# Altium schematic sheet DIOT_Connectors_P1_P6.SchDoc: Switch Matrix 32:2
size 420 x 297 mm; SPICEModelCacheRMUUFYQV: <root> / <DocumentId>RMUUFYQV</DocumentId> / </root>; Author: G.Kasprowicz; CompanyName: WUT ISE; DrawnBy: G.Kasprowicz; Organization: WUT ISE; Address1: PW ISE; Address2: Nowowiejska 15/19 00-665 Warsaw; Address3: gkasprow@gmail.com; DocumentNumber: 5; Revision: 2; SheetNumber: 5; SheetTotal: 6; ModifiedBy: -; CheckedDate: -; Title2: DIOT connectors; DivGrp: WUT ISE; Designer: G.Kasprowicz; ModifiedDate: -; ProjectName: Sensor Box
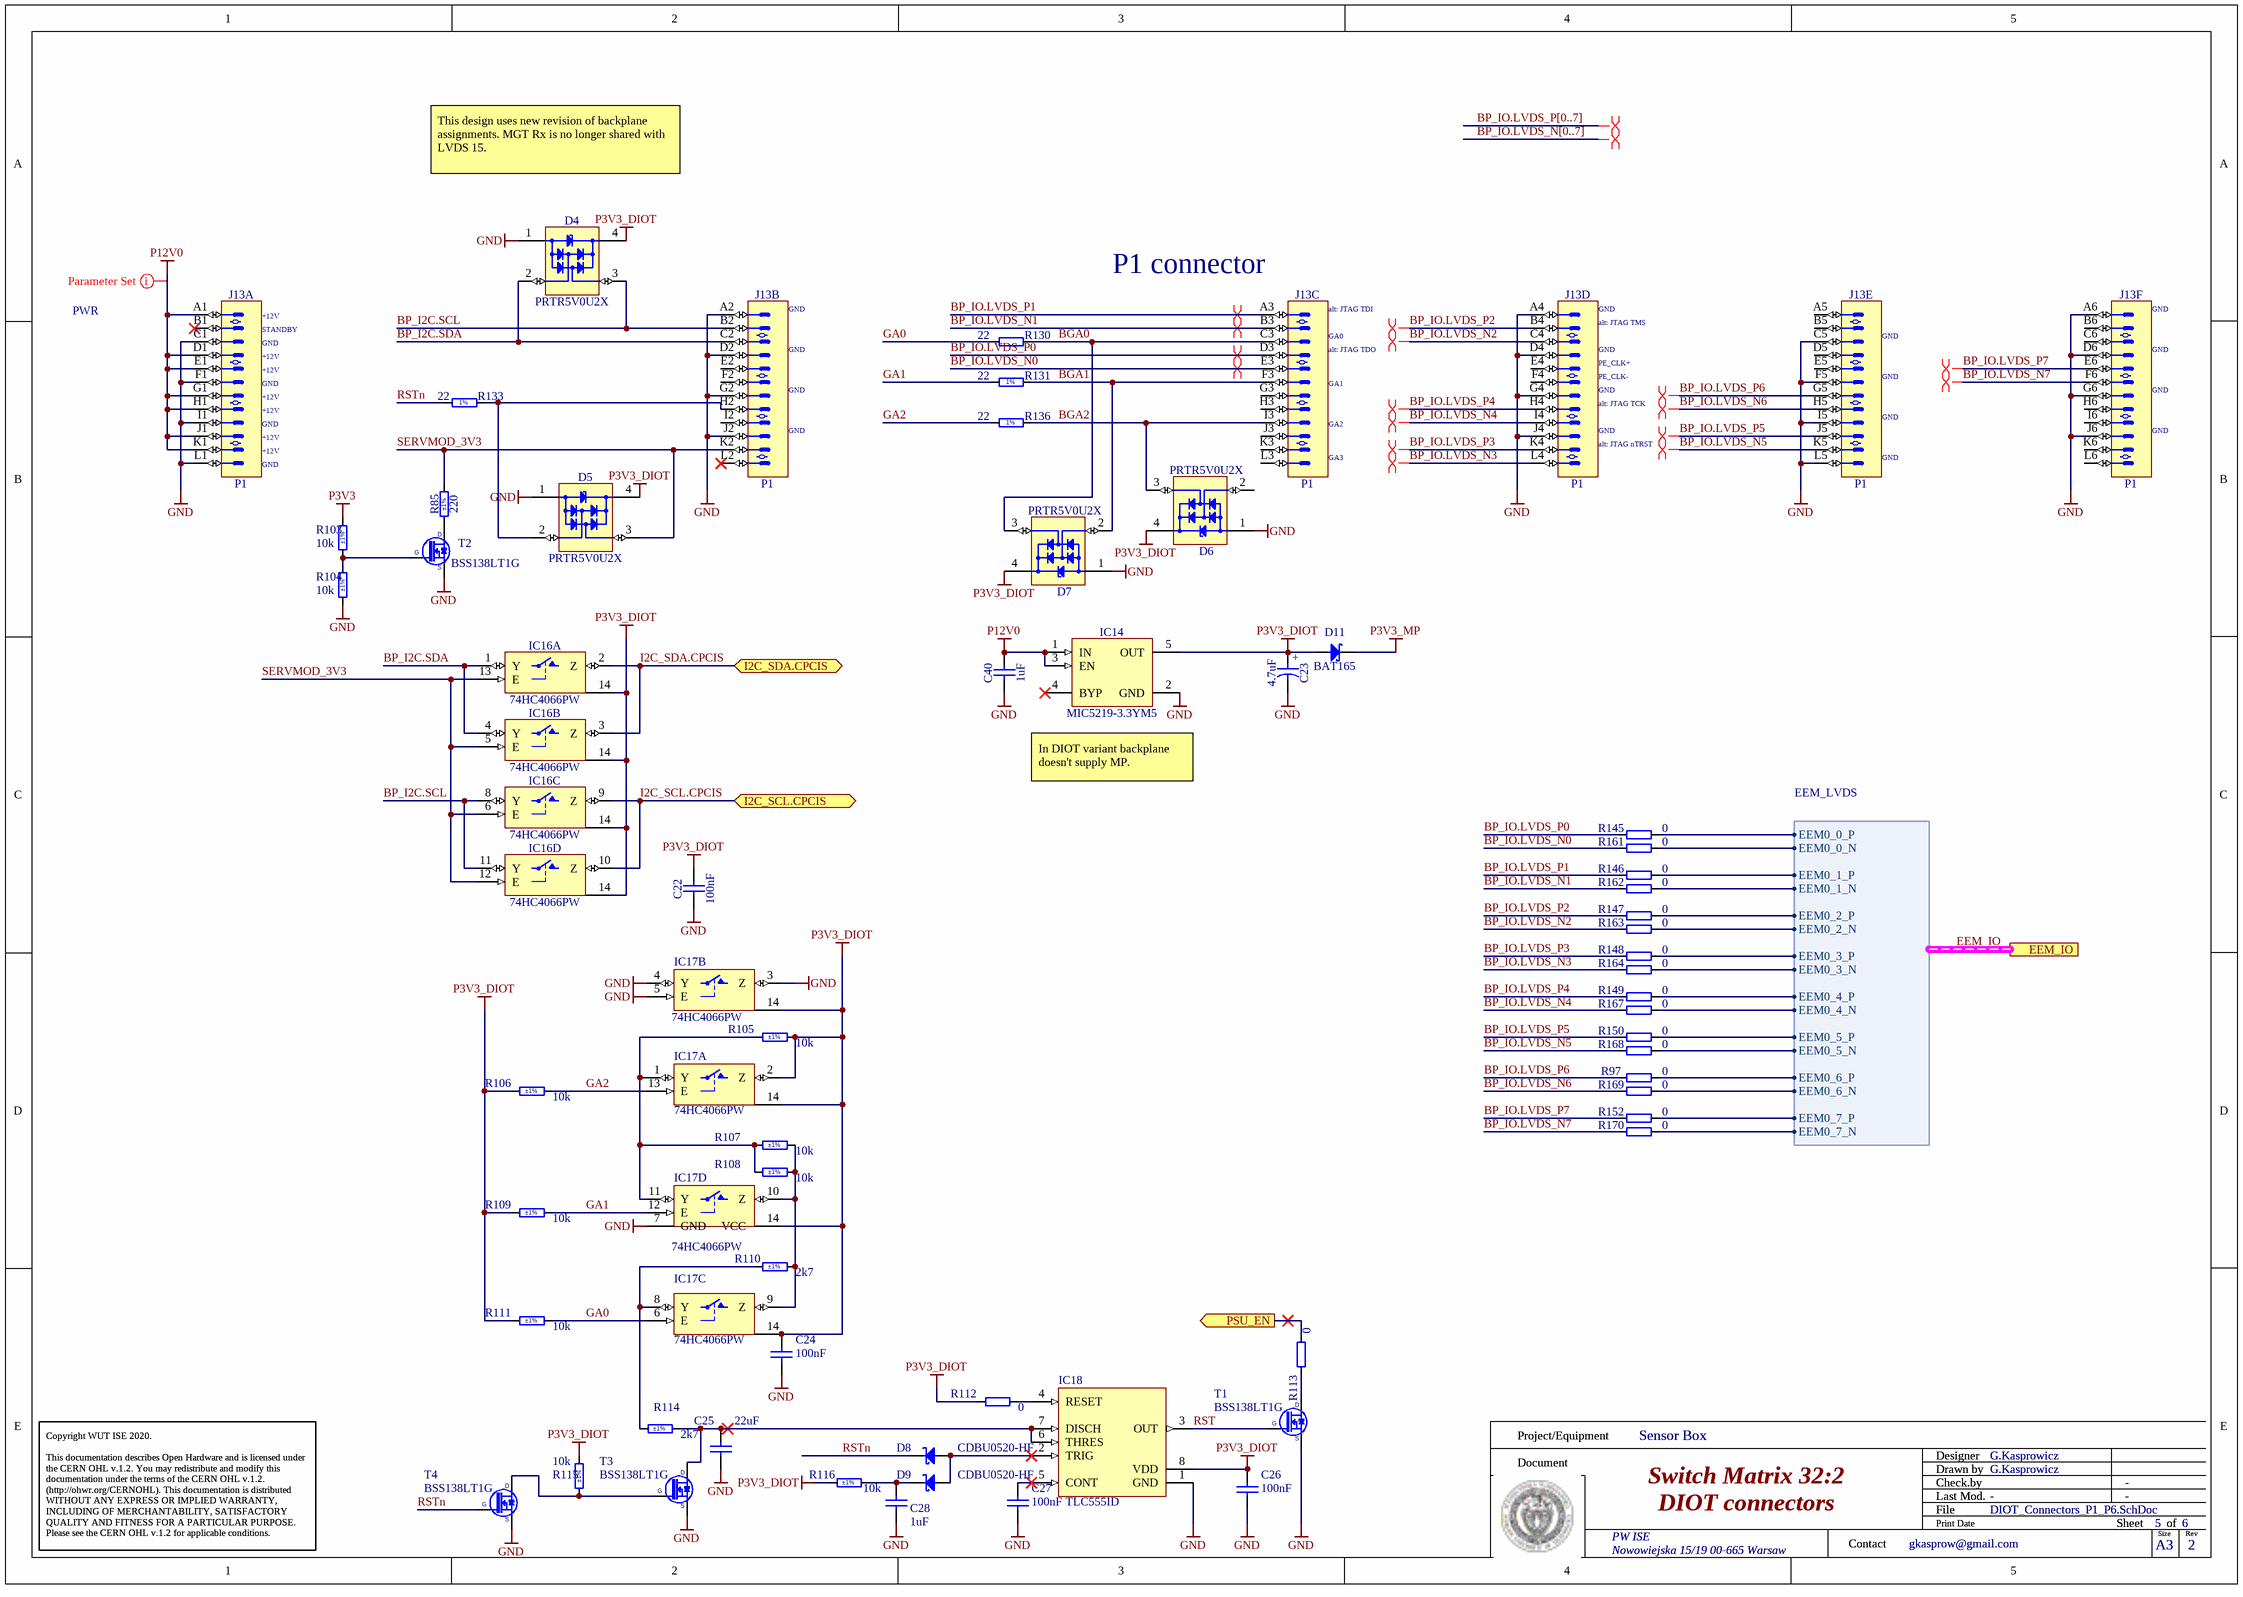
[diagram p0: DIOT_Connectors_P1_P6.SchDoc]

## Parts
C22  100nF  [CAPC1608X87N]
C23  4.7uF  [CAPMP3216X180N]
C24  100nF  [CAPC1608X87N]
C25  22uF  [CAPC2012X135N]
C26  100nF  [CAPC1608X87N]
C27  100nF  [CAPC1608X87N]
C28  1uF  [CAPC1608X87N]
C40  1uF  [CAPC1608X87N]
D4  PRTR5V0U2X  [SOT190P230X110-4N]
D5  PRTR5V0U2X  [SOT190P230X110-4N]
D6  PRTR5V0U2X  [SOT190P230X110-4N]
D7  PRTR5V0U2X  [SOT190P230X110-4N]
D8  CDBU0520-HF  [SOD-523F]
D9  CDBU0520-HF  [SOD-523F]
D11  BAT165  [SOD2512X110N]
IC14  MIC5219-3.3YM5  [SOT95P280X145-5N]
IC16  74HC4066PW  [SOP65P640X110-14N]  (parts A,B,C,D of 4)
IC17  74HC4066PW  [SOP65P640X110-14N]  (parts A,B,C,D of 4)
IC18  TLC555ID  [SOIC127P600X175-8N]
J13  P1  [AMPHENOL_10052825-101LF]  (parts A,B,C,D,E,F of 6)
R85  220  Tolerance: ±1%  [RESC1005X40N]
R97  0  [RESC1608X55N]
R103  10k  Tolerance: ±1%  [RESC1608X55N]
R104  10k  Tolerance: ±1%  [RESC1608X55N]
R105  10k  Tolerance: ±1%  [RESC1608X55N]
R106  10k  Tolerance: ±1%  [RESC1608X55N]
R107  10k  Tolerance: ±1%  [RESC1608X55N]
R108  10k  Tolerance: ±1%  [RESC1608X55N]
R109  10k  Tolerance: ±1%  [RESC1608X55N]
R110  2k7  Tolerance: ±1%  [RESC1608X55N]
R111  10k  Tolerance: ±1%  [RESC1608X55N]
R112  0  [RESC1608X55N]
R113  0  [RESC1608X55N]
R114  2k7  Tolerance: ±1%  [RESC1608X55N]
R115  10k  Tolerance: ±1%  [RESC1608X55N]
R116  10k  Tolerance: ±1%  [RESC1608X55N]
R130  22  [RESC1005X40N]
R131  22  [RESC1005X40N]
R133  22  [RESC1005X40N]
R136  22  [RESC1005X40N]
R145  0  [RESC1608X55N]
R146  0  [RESC1608X55N]
R147  0  [RESC1608X55N]
R148  0  [RESC1608X55N]
R149  0  [RESC1608X55N]
R150  0  [RESC1608X55N]
R152  0  [RESC1608X55N]
R161  0  [RESC1608X55N]
R162  0  [RESC1608X55N]
R163  0  [RESC1608X55N]
R164  0  [RESC1608X55N]
R167  0  [RESC1608X55N]
R168  0  [RESC1608X55N]
R169  0  [RESC1608X55N]
R170  0  [RESC1608X55N]
T1  BSS138LT1G  [SOT95P240X110-3N]
T2  BSS138LT1G  [SOT95P240X110-3N]
T3  BSS138LT1G  [SOT95P240X110-3N]
T4  BSS138LT1G  [SOT95P240X110-3N]

## Ports
EEM_IO (harness EEM_LVDS), I2C_SCL.CPCIS (bidir), I2C_SDA.CPCIS (bidir), PSU_EN (out)

## Harnesses
EEM_LVDS: EEM0_0_P, EEM0_0_N, EEM0_1_P, EEM0_1_N, EEM0_2_P, EEM0_2_N, EEM0_3_P, EEM0_3_N, EEM0_4_P, EEM0_4_N, EEM0_5_P, EEM0_5_N, EEM0_6_P, EEM0_6_N, EEM0_7_P, EEM0_7_N

## Nets
GND: C22.1 C23.2 C24.1 C25.1 C26.1 C27.1 C28.1 C40.1 D4.1(GND) D5.1(GND) D6.1(GND) D7.1(GND) IC14.2(GND) IC16.7(GND) IC17.3(Z) IC17.4(Y) IC17.5(E) IC17.7(GND) IC18.1(GND) J13.A2 J13.A4 J13.A6 J13.C1 J13.C5 J13.D2 J13.D4 J13.D6 J13.F1 J13.F5 J13.G2 J13.G4 J13.G6 J13.I1 J13.I5 J13.J2 J13.J4 J13.J6 J13.L1 J13.L5 R104.1 T1.2(S) T2.2(S) T3.2(S) T4.2(S)
P3V3: R103.2
P3V3_DIOT: C22.2 C23.1 C24.2 C26.2 D4.4(VCC) D5.4(VCC) D6.4(VCC) D7.4(VCC) D11.2(A) IC14.5(OUT) IC16.14(VCC) IC17.2(Z) IC17.14(VCC) IC18.8(VDD) R105.2 R106.1 R109.1 R111.1 R112.1 R115.2 R116.1
P3V3_MP: D11.1(C)
P12V0: C40.2 IC14.1(IN) IC14.3(EN) J13.A1 J13.D1 J13.E1 J13.G1 J13.H1 J13.J1 J13.K1
BGA0: D7.3(I/O2) J13.C3 R130.2
BGA1: D7.2(I/O1) J13.F3 R131.2
BGA2: D6.3(I/O2) J13.I3 R136.2
BP_I2C.SCL: D4.3(I/O2) IC16.8(Y) IC16.11(Y) J13.B2
BP_I2C.SDA: D4.2(I/O1) IC16.1(Y) IC16.4(Y) J13.C2
BP_IO.LVDS_N0: J13.E3 R161.1
BP_IO.LVDS_N1: J13.B3 R162.1
BP_IO.LVDS_N2: J13.C4 R163.1
BP_IO.LVDS_N3: J13.L4 R164.1
BP_IO.LVDS_N4: J13.I4 R167.1
BP_IO.LVDS_N5: J13.K5 R168.1
BP_IO.LVDS_N6: J13.H5 R169.1
BP_IO.LVDS_N7: J13.F6 R170.1
BP_IO.LVDS_P0: J13.D3 R145.1
BP_IO.LVDS_P1: J13.A3 R146.1
BP_IO.LVDS_P2: J13.B4 R147.1
BP_IO.LVDS_P3: J13.K4 R148.1
BP_IO.LVDS_P4: J13.H4 R149.1
BP_IO.LVDS_P5: J13.J5 R150.1
BP_IO.LVDS_P6: J13.G5 R97.1
BP_IO.LVDS_P7: J13.E6 R152.1
EEM_IO.EEM0_0_N: R161.2 ; port EEM_IO.EEM0_0_N
EEM_IO.EEM0_0_P: R145.2 ; port EEM_IO.EEM0_0_P
EEM_IO.EEM0_1_N: R162.2 ; port EEM_IO.EEM0_1_N
EEM_IO.EEM0_1_P: R146.2 ; port EEM_IO.EEM0_1_P
EEM_IO.EEM0_2_N: R163.2 ; port EEM_IO.EEM0_2_N
EEM_IO.EEM0_2_P: R147.2 ; port EEM_IO.EEM0_2_P
EEM_IO.EEM0_3_N: R164.2 ; port EEM_IO.EEM0_3_N
EEM_IO.EEM0_3_P: R148.2 ; port EEM_IO.EEM0_3_P
EEM_IO.EEM0_4_N: R167.2 ; port EEM_IO.EEM0_4_N
EEM_IO.EEM0_4_P: R149.2 ; port EEM_IO.EEM0_4_P
EEM_IO.EEM0_5_N: R168.2 ; port EEM_IO.EEM0_5_N
EEM_IO.EEM0_5_P: R150.2 ; port EEM_IO.EEM0_5_P
EEM_IO.EEM0_6_N: R169.2 ; port EEM_IO.EEM0_6_N
EEM_IO.EEM0_6_P: R97.2 ; port EEM_IO.EEM0_6_P
EEM_IO.EEM0_7_N: R170.2 ; port EEM_IO.EEM0_7_N
EEM_IO.EEM0_7_P: R152.2 ; port EEM_IO.EEM0_7_P
GA0: IC17.6(E) R111.2 R130.1
GA1: IC17.12(E) R109.2 R131.1
GA2: IC17.13(E) R106.2 R136.1
I2C_SCL.CPCIS: IC16.9(Z) IC16.10(Z) ; port I2C_SCL.CPCIS
I2C_SDA.CPCIS: IC16.2(Z) IC16.3(Z) ; port I2C_SDA.CPCIS
PSU_EN: R113.2 ; port PSU_EN
RST: IC18.3(OUT) T1.1(G)
RSTn: D8.1(C) R133.1 T4.1(G)
SERVMOD_3V3: D5.3(I/O2) IC16.5(E) IC16.6(E) IC16.12(E) IC16.13(E) J13.K2 R85.2
NetC25_2: C25.2 IC18.6(THRES) IC18.7(DISCH) R114.2 T3.3(D)
NetC27_2: C27.2 IC18.5(CONT)
NetC28_2: C28.2 D9.1(C) R116.2
NetD5_2: D5.2(I/O1) J13.H2 R133.2
NetD8_2: D8.2(A) D9.2(A) IC18.2(TRIG)
NetIC17_1: IC17.1(Y) IC17.11(Y) R105.1 R107.1 R108.1
NetIC17_8: IC17.8(Y) R110.1 R114.1
NetIC17_9: IC17.9(Z) IC17.10(Z) R107.2 R108.2 R110.2
NetIC18_4: IC18.4(RESET) R112.2
NetR85_1: R85.1 T2.3(D)
NetR103_1: R103.1 R104.2 T2.1(G)
NetR113_1: R113.1 T1.3(D)
NetR115_1: R115.1 T3.1(G) T4.3(D)

Not connected (* = marked no-connect by the designer): D6 2(I/O1); IC14 4(BYP)*; J13 A5 B1* B5 B6 C6 D5 E2 E4 E5 F2 F4 G3 H3 H6 I2 I6 J3 K3 K6 L2* L3 L6

## Buses and harness runs
bus BP_IO.LVDS_N[0..7]
bus BP_IO.LVDS_P[0..7]
harness EEM_IO = port EEM_IO

## Layout directives
differential pair: (no net found under the mark), BP_IO.LVDS_N0, BP_IO.LVDS_N1, BP_IO.LVDS_N2, BP_IO.LVDS_N3, BP_IO.LVDS_N4, BP_IO.LVDS_N5, BP_IO.LVDS_N6, BP_IO.LVDS_N7, BP_IO.LVDS_P0, BP_IO.LVDS_P1, BP_IO.LVDS_P2, BP_IO.LVDS_P3, BP_IO.LVDS_P4, BP_IO.LVDS_P5, BP_IO.LVDS_P6, BP_IO.LVDS_P7
net class PWR: P12V0

## Notes on the sheet
- This design uses new revision of backplane assignments. MGT Rx is no longer shared with LVDS 15.
- (near J13) +12V
- (near J13) GND
- (near J13) P1 connector
- (near J13) alt: JTAG TDI
- (near J13) alt: JTAG TMS
- (near J13) STANDBY
- (near J13) alt: JTAG TDO
- (near J13) GA1
- (near J13) GA0
- (near J13) PE_CLK+
- (near J13) PE_CLK-
- (near J13) GA2
- (near J13) GA3
- (near J13) alt: JTAG TCK
- (near J13) alt: JTAG nTRST
- In DIOT variant backplane doesn't supply MP.
- Project/Equipment
- Document
- Designer
- Drawn by
- Check.by
- Copyright WUT ISE 2020.
  This documentation describes Open Hardware and is licensed under the CERN OHL v.1.2. You may redistribute and modify this documentation under the terms of the CERN OHL v.1.2. (http://ohwr.org/CERNOHL). This documentation is distributed WITHOUT ANY EXPRESS OR IMPLIED WARRANTY, INCLUDING OF MERCHANTABILITY, SATISFACTORY QUALITY AND FITNESS FOR A PARTICULAR PURPOSE. Please see the CERN OHL v.1.2 for applicable conditions.
- Contact
- File
- Last Mod.
- Print Date
- Sheet
- Size
- A3
- of
- Rev
- (in symbol CTE3216-18_4.7UF_10V_10%_AVX_TPSA475K010T1400) +
- (in symbol R0402_22R_1%_0.0625W_100PPM) 1%

## Library data of the parts
C22 C24 C26 C27 = CC0603_100NF_50V_10%_X7R: Non-polarised capacitor; Part Description: SMD Multilayer Chip Ceramic Capacitor; Manufacturer: GENERIC; Manufacturer1 Part Number: 223858615649; Voltage: 50V; TC: X7R; Tolerance: ±10%; Part Number: CC0603_100NF_50V_10%_X7R; Component Kind: Standard; Component Type: Standard; Pin Count: 2; Value: 100nF; Status: Preferred; Manufacturer Part Number: CC0603_100NF_50V_10%_X7R; Case: 0603; Mounted: Yes; Socket: No; SMD: Yes; Sense: No; Manufacturer1 Example: PHYCOMP; Manufacturer1 ComponentHeight: 0.87mm; HelpURL: \\cern.ch\dfs\Applications\Altium\Datasheets\CC0603_X7R_PHYCOMP.pdf; Author: CERN DEM JLC; CreateDate: 03.12.2007; LatestRevisionDate: 03.12.2007
C23 = CTE3216-18_4.7UF_10V_10%_AVX_TPSA475K010T1400: Polarised capacitor; Part Description: Low ESR 1R4 Automotive Solid Tantalum Chip Capacitor; Manufacturer: AVX; Voltage: 10V; Tolerance: ±10%; Part Number: CTE3216-18_4.7UF_10V_10%_AVX_TPSA475K010T1400; Component Kind: Standard; Component Type: Standard; Pin Count: 2; Value: 4.7uF; Status: Preferred; Manufacturer Part Number: TPSA475K010T1400; Case: A; Mounted: Yes; Socket: No; SMD: Yes; Sense: No; ComponentHeight: 1.8mm; HelpURL: \\cern.ch\dfs\Applications\Altium\Datasheets\CTE-LESR_AVX_TPS-AUTO.pdf; Author: CERN DEM JLC; CreateDate: 23.01.2018; LatestRevisionDate: 23.01.2018
C25 = CC0805_22UF_16V_10%_X5R: Non-polarised capacitor; Part Description: SMD Multilayer Chip Ceramic Capacitor; Manufacturer: GENERIC; Manufacturer1 Part Number: C2012X5R1C226KT; Voltage: 16V; TC: X5R; Tolerance: ±10%; Part Number: CC0805_22UF_16V_10%_X5R; Component Kind: Standard; Component Type: Standard; Pin Count: 2; Value: 22uF; Status: Preferred; Manufacturer Part Number: CC0805_22UF_16V_10%_X5R; Case: 0805; Mounted: Yes; Socket: No; SMD: Yes; Sense: No; Manufacturer1 Example: TDK; Manufacturer1 ComponentHeight: 1.35mm; HelpURL: \\cern.ch\dfs\Applications\Altium\Datasheets\CC0805_X5R_TDK_C.pdf; Author: CERN DEM JLC; CreateDate: 25.10.2012; LatestRevisionDate: 25.10.2012
C28 = CC0603_1UF_16V_10%_X7R: Non-polarised capacitor; Part Description: SMD Multilayer Chip Ceramic Capacitor; Manufacturer: GENERIC; Manufacturer1 Part Number: 223878615663; Voltage: 16V; TC: X7R; Tolerance: ±10%; Part Number: CC0603_1UF_16V_10%_X7R; Component Kind: Standard; Component Type: Standard; Pin Count: 2; Value: 1uF; Status: None; Manufacturer Part Number: CC0603_1UF_16V_10%_X7R; Case: 0603; Mounted: Yes; Socket: No; SMD: Yes; Sense: No; Manufacturer1 Example: YAGEO PHYCOMP; Manufacturer1 ComponentHeight: 0.9mm; HelpURL: \\cern.ch\dfs\Applications\Altium\Datasheets\CC0603_X7R_PHYCOMP.pdf; Author: CERN DEM JLC; CreateDate: 03.12.2007; LatestRevisionDate: 17.04.2015
C40 = CC0603_1UF_25V_10%_X7R: Non-polarised capacitor; Part Description: SMD Multilayer Chip Ceramic Capacitor; Manufacturer: GENERIC; Manufacturer1 Part Number: GRM188R71E105KA12D; Voltage: 25V; TC: X7R; Tolerance: ±10%; Part Number: CC0603_1UF_25V_10%_X7R; Component Kind: Standard; Component Type: Standard; Pin Count: 2; Value: 1uF; Status: None; Manufacturer Part Number: CC0603_1UF_25V_10%_X7R; Case: 0603; Mounted: Yes; Socket: No; SMD: Yes; Sense: No; Manufacturer1 Example: MURATA; Manufacturer1 ComponentHeight: 0.9mm; HelpURL: \\cern.ch\dfs\Applications\Altium\Datasheets\CC0603_X7R_MURATA.pdf; Author: CERN DEM JLC; CreateDate: 18.01.2011; LatestRevisionDate: 18.01.2011
D4-D7 = PRTR5V0U2X: Ultra Low Capacitance Double Rail-to-Rail ESD Protection Diode; Part Description: Ultra Low Capacitance (1pF) Double Rail-to-Rail ESD Protection Diode (8kV); Manufacturer: NXP SEMICONDUCTORS; Voltage: 5.5V; PressFit: No; Bonding: No; Part Number: PRTR5V0U2X; Component Kind: Standard; Component Type: Standard; Device: PRTR5V0U2X; PackageDescription: SOT143B, SOT, 1.90mm Pitch; 4 Pin, 1.30mm W X 2.90mm L X 1.10mm H body, IPC Medium Density; Manufacturer Part Number: PRTR5V0U2X; Pin Count: 4; Case: SOT143B; Mounted: Yes; Socket: No; SMD: Yes; Sense: No; ComponentHeight: 1.1mm; HelpURL: \\cern.ch\dfs\Applications\Altium\Datasheets\PRTR5V0U2X.pdf; Author: CERN DEM JLC; CreateDate: 22.03.2011; LatestRevisionDate: 22.03.2011
D8 D9 = CDBU0520-HF: Schottky Diode; Part Description: 20V Surface mount Schottky Barrier Diode; Manufacturer: COMCHIP; Voltage: 20V; Power: 500mA; PressFit: No; Bonding: No; Part Number: CDBU0520-HF; Component Kind: Standard; Component Type: Standard; Device: CDBU0520-HF; PackageDescription: Small Outline Diode Flat Lead (SOD-523F), Body; 1.80mm L X 1mm W X 0.85mm H; Manufacturer Part Number: CDBU0520-HF; Pin Count: 2; Case: SOD-523F; Mounted: Yes; Socket: No; SMD: Yes; Sense: No; ComponentHeight: 1mm; HelpURL: \\cern.ch\dfs\Applications\Altium\Datasheets\CDBU0520-HF.pdf; Author: CERN DEM HF; CreateDate: 13.10.2023; LatestRevisionDate: 13.10.2023
D11 = BAT165: Schottky Diode; Manufacturer: INFINEON; Part Description: Medium Power AF Schottky Diode; Voltage: 40V; Power: 750mA; PressFit: No; Bonding: No; Manufacturer Part Number: BAT165; PackageDescription: Small Outline Diode (SOD-323), 1.70mm W X 1.25mm L X 1.10mm H body,  IPC Medium Density; Part Number: BAT165; Component Kind: Standard; Component Type: Standard; Device: BAT165; Pin Count: 2; Case: SOD323; Mounted: Yes; Socket: No; SMD: Yes; Sense: No; ComponentHeight: 1.1mm; HelpURL: \\cern.ch\dfs\Applications\Altium\Datasheets\BAT165.pdf; Author: CERN DEM JLC; CreateDate: 12.11.2014; LatestRevisionDate: 12.11.2014
IC14 = MIC5219-3.3YM5: 500mA Peak Output LDO Regulator; Part Description: 3.3V 500mA Peak Output Low Drop-Out  (LDO) Regulator; Manufacturer: MICROCHIP TECHNOLOGY; PressFit: No; Bonding: No; Part Number: MIC5219-3.3YM5; Component Kind: Standard; Component Type: Standard; Device: MIC5219-3.3YM5; PackageDescription: SOT, 0.95mm pitch; 5 pin, 1.60mm W X 2.90mm L X 1.45mm H body, IPC Medium Density; Manufacturer Part Number: MIC5219-3.3YM5; Pin Count: 5; Case: SOT23-5; Mounted: Yes; Socket: No; SMD: Yes; Sense: No; ComponentHeight: 1.45mm; HelpURL: \\cern.ch\dfs\Applications\Altium\Datasheets\MIC5219-3.3YM5.pdf; Author: CERN DEM WB; CreateDate: 2019-04-16; LatestRevisionDate: 2019-04-16
IC16 = 74HC4066PW: Part Description: Quad Single-Pole Single-Throw Analog Switch; Manufacturer: NXP SEMICONDUCTORS; PressFit: No; Bonding: No; Part Number: 74HC4066PW; Component Kind: Standard; Component Type: Standard; Device: 74HC4066PW; PackageDescription: SOP, 14-Leads, Body 4.4x5mm (max), Pitch 0.65mm, IPC Medium Density; Manufacturer Part Number: 74HC4066PW; Pin Count: 14; Case: TSSOP14; Mounted: Yes; Socket: No; SMD: Yes; Sense: No; ComponentHeight: 1.1mm; Author: CERN DEM JLC; HelpURL: \\cern.ch\dfs\Applications\Altium\Datasheets\74HC4066PW.pdf; CreateDate: 19.11.2014; LatestRevisionDate: 19.11.2014
IC17 = 74HC4066PW: Part Description: Quad Single-Pole Single-Throw Analog Switch; Manufacturer: NXP SEMICONDUCTORS; PressFit: No; Bonding: No; Table: Standard Logic; Part Number: 74HC4066PW; Component Kind: Standard; Component Type: Standard; Device: 74HC4066PW; PackageDescription: SOP, 14-Leads, Body 4.4x5mm (max), Pitch 0.65mm, IPC Medium Density; Manufacturer Part Number: 74HC4066PW; Pin Count: 14; Case: TSSOP14; Mounted: Yes; Socket: No; SMD: Yes; ComponentHeight: 1.1mm; Author: CERN DEM JLC; HelpURL: \\cern.ch\dfs\Applications\Altium\Datasheets\74HC4066PW.pdf; CreateDate: 2014-11-19; LatestRevisionDate: 2014-11-19
IC18 = TLC555ID: LinCMOS Timer; Manufacturer: TEXAS INSTRUMENTS; PressFit: No; Bonding: No; Part Number: TLC555ID; Component Kind: Standard; Component Type: Standard; Device: TLC555ID; PackageDescription: SOIC 8, Pitch 1.27mm, Body 4x5mm, IPC Medium Density; Part Description: LinCMOS Timer; Manufacturer Part Number: TLC555ID; Pin Count: 8; Case: SOIC8; Mounted: Yes; Socket: No; SMD: Yes; Sense: No; ComponentHeight: 1.75mm; Author: CERN DEM JMW; HelpURL: \\cern.ch\dfs\Applications\Altium\Datasheets\TLC555ID.pdf; CreateDate: 23.08.2016; LatestRevisionDate: 23.08.2016
J13 = AMPHENOL_10052825-101LF: 72 Contacts Header, 6 Columns, 4 Pairs per Column; Part Description: 72 Contacts, 2mm Pitch, 6 Columns, 4 Pairs per Column, 4 Walls, Right Angle Header; Part Number: AMPHENOL_10052825-101LF; Component Kind: Standard; Component Type: Standard; Pin Count: 72; Family: AirMax VS; Mounted: Yes; Socket: No; SMD: No; PressFit: Yes; Sense: No; Status: None; Manufacturer: AMPHENOL; Manufacturer Part Number: 10052825-101LF; ComponentHeight: 15.35mm; HelpURL: \\cern.ch\dfs\Applications\Altium\Datasheets\AMPHENOL_10052825-101LF.pdf; ComponentLink1URL: \\cern.ch\dfs\Applications\Altium\Datasheets\AMPHENOL_10052825-101LF_Application.pdf; ComponentLink1Description: Application; Author: CERN DEM MR; CreateDate: 19/02/2018; LatestRevisionDate: 19/02/2018; Classname: Overlapping
R85 = R0402_220R_1%_0.0625W_100PPM: Resistor - 1%; Part Description: General Purpose Thick Film Chip Resistor; Manufacturer: GENERIC; Manufacturer1 Part Number: 232270672201L; TC: ±100ppm/°C; PressFit: No; Part Number: R0402_220R_1%_0.0625W_100PPM; Component Kind: Standard; Component Type: Standard; Pin Count: 2; Value: 220; Status: Not Recommended; Power: 0.0625W; Manufacturer Part Number: R0402_220R_1%_0.0625W_100PPM; Case: 0402; Mounted: Yes; Sense: No; Socket: No; SMD: Yes; Manufacturer1 Example: YAGEO PHYCOMP; Manufacturer1 ComponentHeight: 0.4mm; HelpURL: \\cern.ch\dfs\Applications\Altium\Datasheets\R0402_Phycomp_RC0402.pdf; Author: CERN DEM JLC; CreateDate: 03.12.2007; LatestRevisionDate: 17.10.2012
R97 R112 R113 R145-R150 R152 R161-R164 R167-R170 = R0603_0R_JUMPER: Resistor; Part Description: 1A (0.05R Max DC Resistance) Zero Ohm Jumper; Manufacturer: GENERIC; Manufacturer1 Part Number: NRC06Z0; PressFit: No; Part Number: R0603_0R_JUMPER; Component Kind: Standard; Component Type: Standard; Pin Count: 2; Value: 0; Status: Preferred; Manufacturer Part Number: R0603_0R_JUMPER; Case: 0603; Mounted: Yes; Sense: No; Socket: No; SMD: Yes; Manufacturer1 Example: NIC COMPONENT; Manufacturer1 ComponentHeight: 0.55mm; HelpURL: \\cern.ch\dfs\Applications\Altium\Datasheets\R0603_NIC_NRC.pdf; Author: CERN DEM JLC; CreateDate: 03.12.2007; LatestRevisionDate: 13.03.2008
R103-R109 R111 R115 R116 = R0603_10K_1%_0.1W_100PPM: Resistor - 1%; Part Description: General Purpose Thick Film Chip Resistor; Manufacturer: GENERIC; Manufacturer1 Part Number: NRC06F1002TRF; Power: 0.1W; TC: ±100ppm/°C; PressFit: No; Part Number: R0603_10K_1%_0.1W_100PPM; Component Kind: Standard; Component Type: Standard; Pin Count: 2; Value: 10k; Status: Preferred; Manufacturer Part Number: R0603_10K_1%_0.1W_100PPM; Case: 0603; Mounted: Yes; Sense: No; Socket: No; SMD: Yes; Manufacturer1 Example: NIC COMPONENT; Manufacturer1 ComponentHeight: 0.55mm; HelpURL: \\cern.ch\dfs\Applications\Altium\Datasheets\R0603_NIC_NRC.pdf; Author: CERN DEM JLC; CreateDate: 03.12.2007; LatestRevisionDate: 13.03.2008
R110 R114 = R0603_2K7_1%_0.1W_100PPM: Resistor - 1%; Part Description: General Purpose Thick Film Chip Resistor; Manufacturer: GENERIC; Manufacturer1 Part Number: RC0603FR-072K7L; Power: 0.1W; TC: ±100ppm/°C; PressFit: No; Part Number: R0603_2K7_1%_0.1W_100PPM; Component Kind: Standard; Component Type: Standard; Pin Count: 2; Value: 2k7; Status: Preferred; Manufacturer Part Number: R0603_2K7_1%_0.1W_100PPM; Case: 0603; Mounted: Yes; Sense: No; Socket: No; SMD: Yes; Manufacturer1 Example: YAGEO PHYCOMP; Manufacturer1 ComponentHeight: 0.55mm; HelpURL: \\cern.ch\dfs\Applications\Altium\Datasheets\R0603_PHYCOMP_RC0603.pdf; Author: CERN DEM JLC; CreateDate: 02.05.2011; LatestRevisionDate: 02.05.2011
R130 R131 R133 R136 = R0402_22R_1%_0.0625W_100PPM: Resistor - 1%; Part Description: General Purpose Thick Film Chip Resistor; Manufacturer: GENERIC; Manufacturer1 Part Number: 232270672209L; PressFit: No; Part Number: R0402_22R_1%_0.0625W_100PPM; Component Kind: Standard; Component Type: Standard; Pin Count: 2; Value: 22; Status: Not Recommended; Power: 0.0625W; Tolerance: ±1%; Manufacturer Part Number: R0402_22R_1%_0.0625W_100PPM; Case: 0402; Mounted: Yes; Socket: No; SMD: Yes; Manufacturer1 Example: YAGEO PHYCOMP; Manufacturer1 ComponentHeight: 0.4mm; HelpURL: \\cern.ch\dfs\Applications\Altium\Datasheets\R0402_Phycomp_RC0402.pdf; Author: CERN DEM JLC; CreateDate: 03.12.2007; LatestRevisionDate: 17.10.2012; Sense: No
T1-T4 = BSS138LT1G: N-CHANNEL MOSFET WITH DIODE; Part Description: 50V, 200mA N-Channel Enhancement Mode Field-Effect Transistor; Manufacturer: ON SEMICONDUCTOR; PressFit: No; Bonding: No; Part Number: BSS138LT1G; Component Kind: Standard; Component Type: Standard; Device: BSS138LT1G; PackageDescription: SOT23, 0.95mm Pitch; 3 Pin, 1.40mm W X 3.00mm L X 1.10mm H body, IPC Medium Density; Manufacturer Part Number: BSS138L; Pin Count: 3; Case: SOT23-3; Mounted: Yes; Socket: No; SMD: Yes; Sense: No; ComponentHeight: 1.11mm; HelpURL: \\cern.ch\dfs\Applications\Altium\Datasheets\BSS138LT1G.pdf; Author: CERN DEM JLC; CreateDate: 23.03.2009; LatestRevisionDate: 25.05.2022